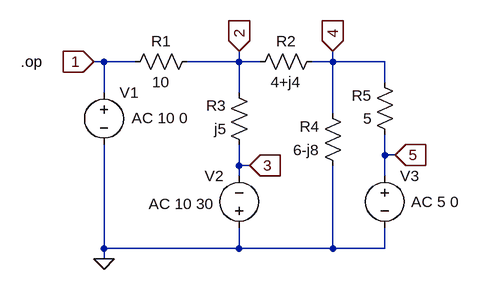
[diagram p0: schematic Phasor-analysis.asc]
Phasor-analysis.asc, the LTspice schematic file:
Version 4
SHEET 1 880 680
WIRE -64 48 -80 48
WIRE -16 48 -64 48
WIRE 144 48 144 32
WIRE 144 48 64 48
WIRE 176 48 144 48
WIRE 288 48 288 32
WIRE 288 48 256 48
WIRE 368 48 288 48
WIRE 368 80 368 48
WIRE -64 96 -64 48
WIRE 144 96 144 48
WIRE 288 128 288 48
WIRE 368 192 368 160
WIRE 384 192 368 192
WIRE 144 208 144 176
WIRE 160 208 144 208
WIRE 144 224 144 208
WIRE 368 224 368 192
WIRE -64 336 -64 176
WIRE 144 336 144 304
WIRE 144 336 -64 336
WIRE 288 336 288 208
WIRE 288 336 144 336
WIRE 368 336 368 304
WIRE 368 336 288 336
WIRE -64 352 -64 336
FLAG -80 48 1
IOPIN -80 48 In
FLAG 144 32 2
IOPIN 144 32 In
FLAG 160 208 3
IOPIN 160 208 In
FLAG 288 32 4
IOPIN 288 32 In
FLAG 384 192 5
IOPIN 384 192 In
FLAG -64 352 0
SYMBOL voltage -64 80 R0
WINDOW 123 43 55 Left 2
WINDOW 39 0 0 Left 0
SYMATTR Value2 AC 10 0
SYMATTR InstName V1
SYMATTR Value ""
SYMBOL voltage 144 320 R180
WINDOW 0 24 96 Left 2
WINDOW 3 24 16 Left 2
WINDOW 123 39 53 Left 2
WINDOW 39 0 0 Left 0
SYMATTR InstName V2
SYMATTR Value ""
SYMATTR Value2 AC 10 30
SYMBOL voltage 368 208 R0
WINDOW 123 41 56 Left 2
WINDOW 39 0 0 Left 0
SYMATTR Value2 AC 5 0
SYMATTR InstName V3
SYMATTR Value ""
SYMBOL res 80 32 R90
WINDOW 0 0 56 VBottom 2
WINDOW 3 32 56 VTop 2
SYMATTR InstName R1
SYMATTR Value 10
SYMBOL res 272 32 R90
WINDOW 0 0 56 VBottom 2
WINDOW 3 32 56 VTop 2
SYMATTR InstName R2
SYMATTR Value 4+j4
SYMBOL res 160 192 R180
WINDOW 0 36 76 Left 2
WINDOW 3 36 40 Left 2
SYMATTR InstName R3
SYMATTR Value j5
SYMBOL res 304 224 R180
WINDOW 0 36 76 Left 2
WINDOW 3 36 40 Left 2
SYMATTR InstName R4
SYMATTR Value 6-j8
SYMBOL res 384 176 R180
WINDOW 0 36 76 Left 2
WINDOW 3 36 40 Left 2
SYMATTR InstName R5
SYMATTR Value 5
TEXT -192 48 Left 2 !.op

The netlist it stands for:
* Phasor-analysis.asc
V1 1 0 AC 10 0
V2 0 3 AC 10 30
V3 5 0 AC 5 0
R1 2 1 10
R2 4 2 4+j4
R3 3 2 j5
R4 0 4 6-j8
R5 5 4 5
.op
.backanno
.end